# Altium schematic sheet IR.SchDoc
size A4; SheetNumber: 2; SheetTotal: 5; SPICEModelCacheFKEPQCTG: <root> / <DocumentId>FKEPQCTG</DocumentId> / </root>
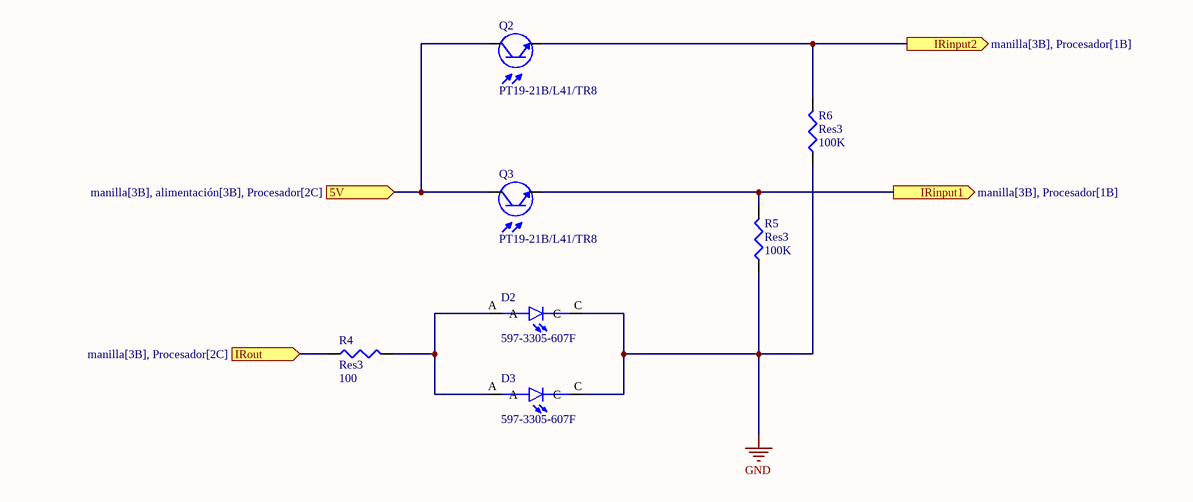
[diagram p0: IR.SchDoc]

## Parts
D2  597-3305-607F  [LEDC2012X70N]
D3  597-3305-607F  [LEDC2012X70N]
Q2  PT19-21B/L41/TR8  [XDCR_PT19-21B/L41/TR8]
Q3  PT19-21B/L41/TR8  [XDCR_PT19-21B/L41/TR8]
R4  Res3  value 100  [J1-0603]
R5  Res3  value 100K  [J1-0603]
R6  Res3  value 100K  [J1-0603]

## Ports
5V (in, see manilla[3B], alimentación[3B], Procesador[2C]), IRinput1 (out, see manilla[3B], Procesador[1B]), IRinput2 (out, see manilla[3B], Procesador[1B]), IRout (in, see manilla[3B], Procesador[2C])

## Nets
GND: D2.C D3.C R5.1 R6.1
5V: Q2.C Q3.C ; port 5V
IRinput1: Q3.E R5.2 ; port IRinput1
IRinput2: Q2.E R6.2 ; port IRinput2
IRout: R4.1 ; port IRout
NetD2_A: D2.A D3.A R4.2

## Library data of the parts
D2 D3 = 597-3305-607F: LED Uni-Color Green 4-Pin Chip 0805 T/R; Availability: Unavailable; Value: *; Price: None; MP: 597-3305-607F; Package: None
Q2 Q3 = PT19-21B/L41/TR8: Phototransistors 940nm Top View 0603 (1608 Metric); Package: None; Price: None; Value: *; MP: PT19-21B/L41/TR8; Availability: Unavailable
R4-R6 = Res3: Resistor; Published: 8-Jun-2000; LatestRevisionDate: 29-May-2009; LatestRevisionNote: IPC-7351 Footprint Added.; PackageReference: J1-0603; Publisher: Altium Limited; PackageDescription: Chip Resistor